# Altium project 74HC595.PrjPcb
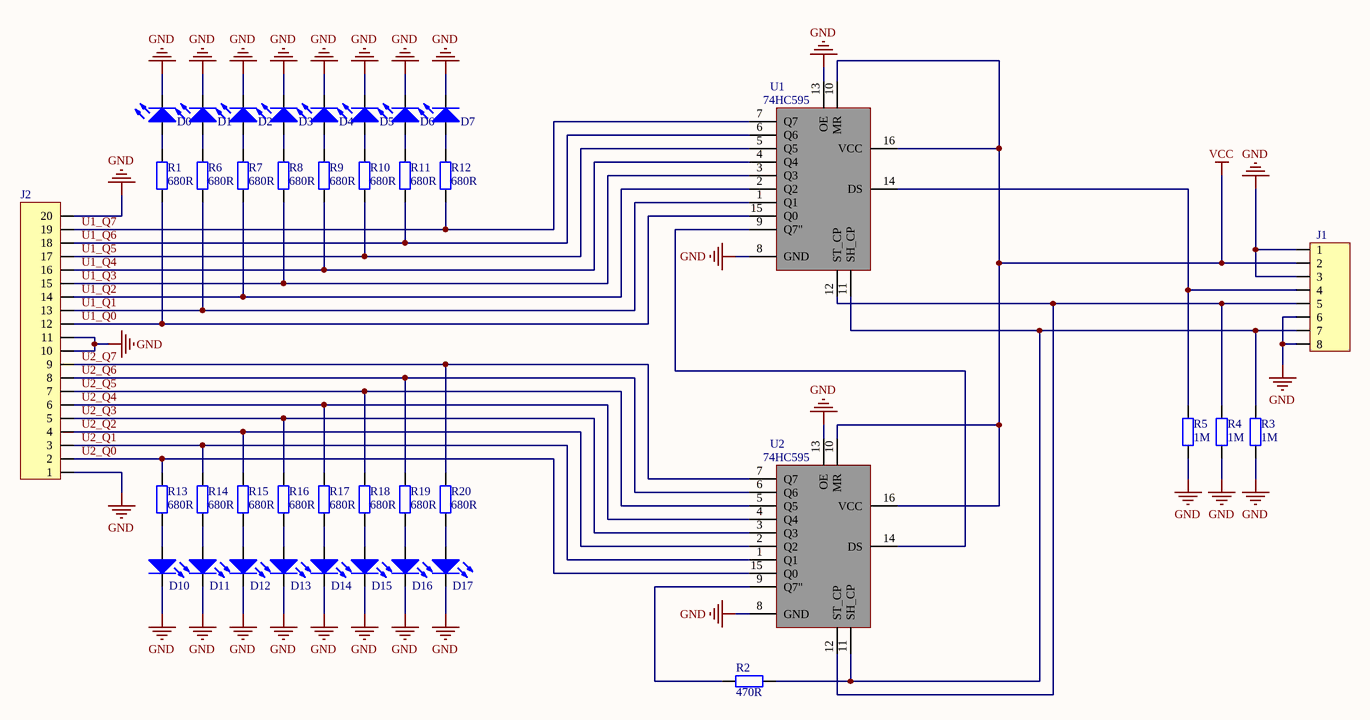
[diagram p0: 74HC595.SchDoc]
1 sheet, 40 parts. Net scope: global (net labels, ports and power ports of the same name join across sheets).
Board file: 74HC595.PcbDoc

## Sheet 74HC595.SchDoc
size A3; Organization: Altium Limited; Address1: L3, 12a Rodborough Rd; Address2: Frenchs Forest; Address3: NSW; Address4: Australia 2086

### Parts
D0  LED0  [1206LED]  (value not drawn)
D1  LED0  [1206LED]  (value not drawn)
D2  LED0  [1206LED]  (value not drawn)
D3  LED0  [1206LED]  (value not drawn)
D4  LED0  [1206LED]  (value not drawn)
D5  LED0  [1206LED]  (value not drawn)
D6  LED0  [1206LED]  (value not drawn)
D7  LED0  [1206LED]  (value not drawn)
D10  LED0  [1206LED]  (value not drawn)
D11  LED0  [1206LED]  (value not drawn)
D12  LED0  [1206LED]  (value not drawn)
D13  LED0  [1206LED]  (value not drawn)
D14  LED0  [1206LED]  (value not drawn)
D15  LED0  [1206LED]  (value not drawn)
D16  LED0  [1206LED]  (value not drawn)
D17  LED0  [1206LED]  (value not drawn)
J1  Header8  [8P-2.54-H]  (value not drawn)
J2  Header20  [20P-2.54-H]  (value not drawn)
R1  680R  [0805R_M]
R2  470R  [0805R_M]
R3  1M  [0805R_M]
R4  1M  [0805R_M]
R5  1M  [0805R_M]
R6  680R  [0805R_M]
R7  680R  [0805R_M]
R8  680R  [0805R_M]
R9  680R  [0805R_M]
R10  680R  [0805R_M]
R11  680R  [0805R_M]
R12  680R  [0805R_M]
R13  680R  [0805R_M]
R14  680R  [0805R_M]
R15  680R  [0805R_M]
R16  680R  [0805R_M]
R17  680R  [0805R_M]
R18  680R  [0805R_M]
R19  680R  [0805R_M]
R20  680R  [0805R_M]
U1  74HC595  [SOIC-16_150mil]
U2  74HC595  [SOIC-16_150mil]

### Nets
GND: D0.2(K) D1.2(K) D2.2(K) D3.2(K) D4.2(K) D5.2(K) D6.2(K) D7.2(K) D10.2(K) D11.2(K) D12.2(K) D13.2(K) D14.2(K) D15.2(K) D16.2(K) D17.2(K) J1.1 J1.3 J1.6 J1.8 J2.1 J2.10 J2.11 J2.20 R3.2 R4.2 R5.2 U1.8(GND) U1.13(OE) U2.8(GND) U2.13(OE)
VCC: J1.2 U1.10(MR) U1.16(VCC) U2.10(MR) U2.16(VCC)
U1_Q0: J2.12 R1.2 U1.15(Q0)
U1_Q1: J2.13 R6.2 U1.1(Q1)
U1_Q2: J2.14 R7.2 U1.2(Q2)
U1_Q3: J2.15 R8.2 U1.3(Q3)
U1_Q4: J2.16 R9.2 U1.4(Q4)
U1_Q5: J2.17 R10.2 U1.5(Q5)
U1_Q6: J2.18 R11.2 U1.6(Q6)
U1_Q7: J2.19 R12.2 U1.7(Q7)
U2_Q0: J2.2 R13.1 U2.15(Q0)
U2_Q1: J2.3 R14.1 U2.1(Q1)
U2_Q2: J2.4 R15.1 U2.2(Q2)
U2_Q3: J2.5 R16.1 U2.3(Q3)
U2_Q4: J2.6 R17.1 U2.4(Q4)
U2_Q5: J2.7 R18.1 U2.5(Q5)
U2_Q6: J2.8 R19.1 U2.6(Q6)
U2_Q7: J2.9 R20.1 U2.7(Q7)
NetD0_1: D0.1(A) R1.1
NetD1_1: D1.1(A) R6.1
NetD2_1: D2.1(A) R7.1
NetD3_1: D3.1(A) R8.1
NetD4_1: D4.1(A) R9.1
NetD5_1: D5.1(A) R10.1
NetD6_1: D6.1(A) R11.1
NetD7_1: D7.1(A) R12.1
NetD10_1: D10.1(A) R13.2
NetD11_1: D11.1(A) R14.2
NetD12_1: D12.1(A) R15.2
NetD13_1: D13.1(A) R16.2
NetD14_1: D14.1(A) R17.2
NetD15_1: D15.1(A) R18.2
NetD16_1: D16.1(A) R19.2
NetD17_1: D17.1(A) R20.2
NetJ1_4: J1.4 R5.1 U1.14(DS)
NetJ1_5: J1.5 R4.1 U1.12(ST_CP) U2.12(ST_CP)
NetJ1_7: J1.7 R2.2 R3.1 U1.11(SH_CP) U2.11(SH_CP)
NetR2_1: R2.1 U2.9(Q7")
NetU1_9: U1.9(Q7") U2.14(DS)

### Notes on the sheet
- Title
- Size:
- Date:
- A3
- Number:
- Time:
- Revision:
- Sheet
- of
- File:

### Library data of the parts
D0-D7 D10-D17 = LED0: LED灯; Published: 8-Jun-2000; LatestRevisionDate: 08-Jul-2005; LatestRevisionNote: Mech Layer 1 removed.; PackageReference: LED-0; Publisher: Altium Limited; PackageDescription: LED; 2 Leads
J1 = Header8: 8PIN插座
J2 = Header20: 20PIN插座
R1-R20 = Res: 电阻; Published: 8-Jun-2000; LatestRevisionDate: 17-Jul-2002; LatestRevisionNote: Re-released for DXP Platform.; PackageReference: AXIAL-0.4; Publisher: Altium Limited; PackageDescription: Axial Device, Thru-Hole; 2 Leads; 0.4 in Pin Spacing
U1 U2 = 74LS595: 移位寄存器